# EasyEDA Pro project ProPrj_VFD-CLOCK_2024-10-19.epro, schematic Schematic2
Create Date: 2024-04-16; Page Name: P1; Project Name: VFD-CLOCK; Schematic Name: Schematic2; Update Date: 2024-04-16; Company: 嘉立创EDA; Page Size: A3; Version: V1.0
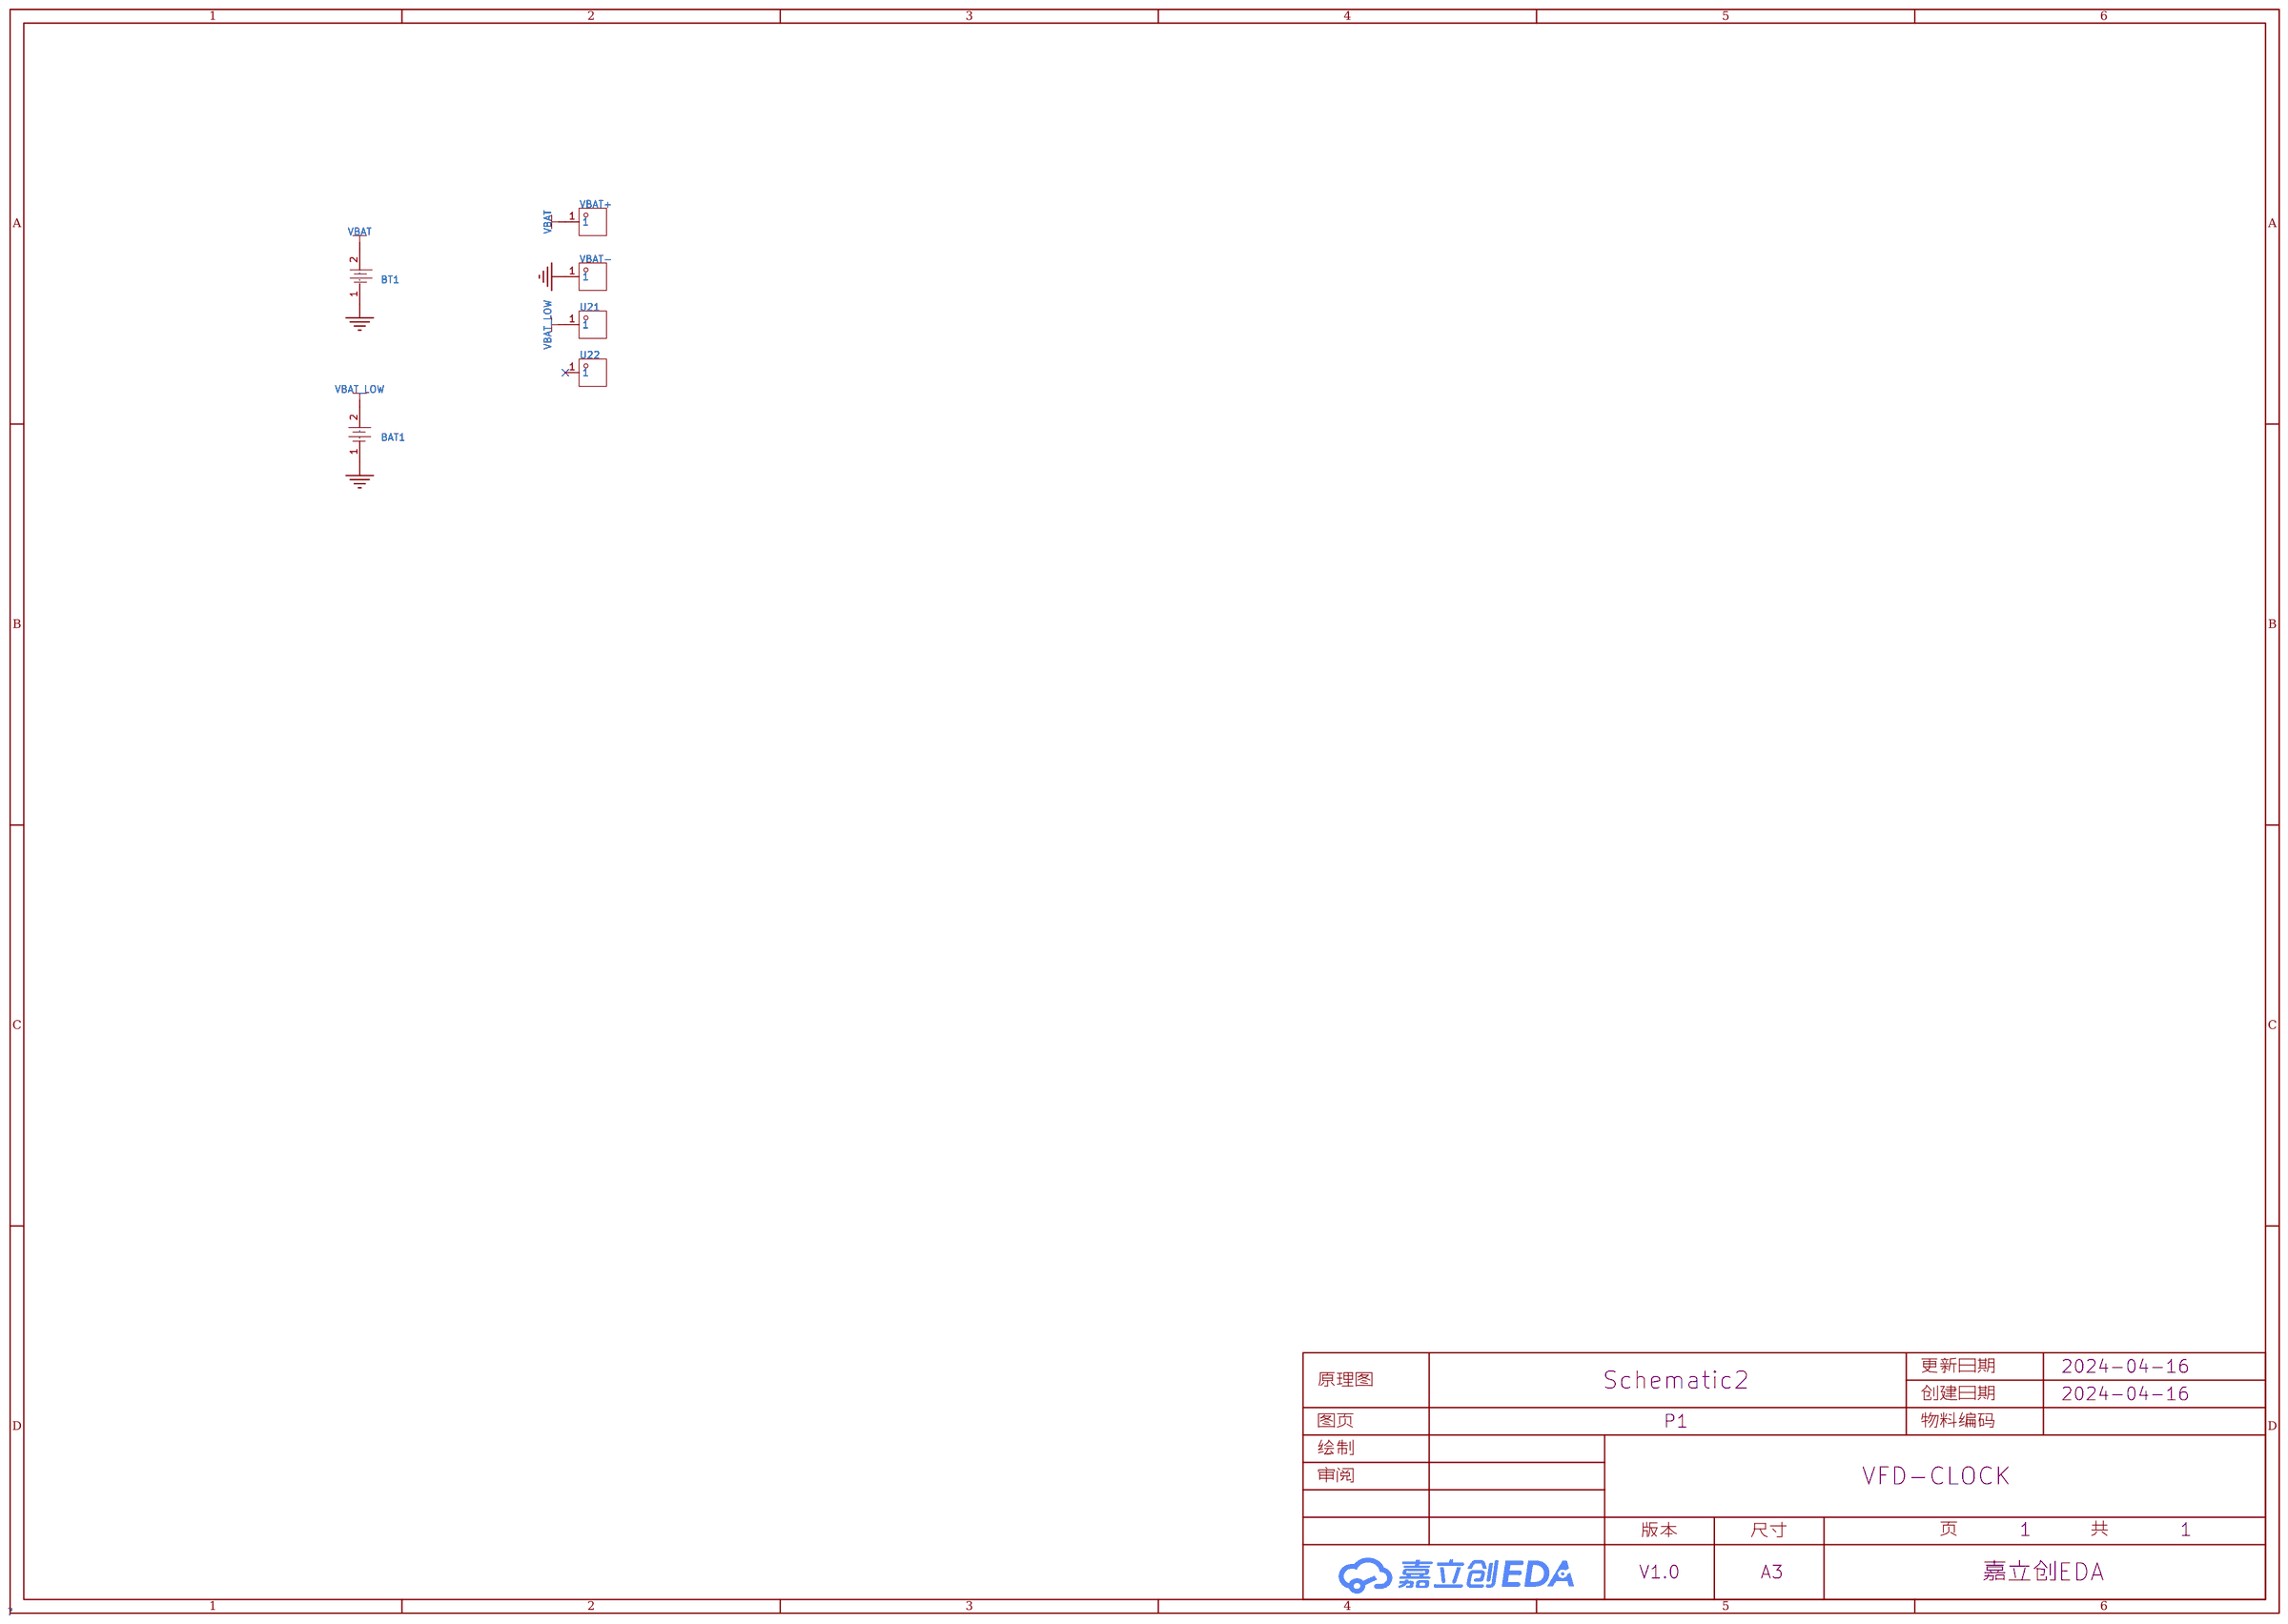
[diagram p0: schematic sheet]

## Parts
BAT1  BS-CR2032-8  [BAT-SMD_BS-CR2032-8]
BT1  BH-18650-A1AJ006  [BAT-TH_BH-18650-A1AJ006]
U21  M2*10+3六角单通铜  [CONN-TH_C9900012092]
U22  M2*10+3六角单通铜  [CONN-TH_C9900012092]
VBAT+  M2*10+3六角单通铜  [CONN-TH_C9900012092]
VBAT-  M2*10+3六角单通铜  [CONN-TH_C9900012092]

## Library data of the parts
BAT1 = BS-CR2032-8: 连接器类型:电池底座;适用电池规格:CR2032;触头材质:铜端;触点电镀:金;工作温度范围:-40℃~+85℃;; LCSC Part Name: 电池座 CR2032-BS-8贴片式 电池底座; Supplier Part: C7498149; Manufacturer: LX(连欣科技); Supplier Footprint: SMD; Datasheet: https://atta.szlcsc.com/upload/public/pdf/source/20230925/275539F3265A587241B200E8332449D9.pdf; Supplier: LCSC; Connector Type: 电池底座; Battery Type: CR2032; Contact Material: 铜端; Contact Plating: 金; Operating Temperature Range: -40℃~+85℃
BT1 = BH-18650-A1AJ006: 连接器类型:电池盒;适用电池规格:18650;; LCSC Part Name: 电池盒 适用电池:18650; Supplier Part: C5290175; Manufacturer: MYOUNG(美阳); JLCPCB Part Class: 扩展库; Datasheet: https://atta.szlcsc.com/upload/public/pdf/source/20221129/6A895ABB0802E35760FE4A36BAA105B3.pdf; Supplier: LCSC; Connector Type: 电池盒; Battery Type: 18650
U21 U22 VBAT+ VBAT- = M2*10+3六角单通铜: Supplier Part: C9900012092; JLCPCB Part Class: 扩展库; Supplier: LCSC

## Nets
GND: BAT1.1 BT1.1 VBAT-.1
VBAT: BT1.2 VBAT+.1
VBAT_LOW: BAT1.2 U21.1

Not connected (* = marked no-connect by the designer): U22 1*
